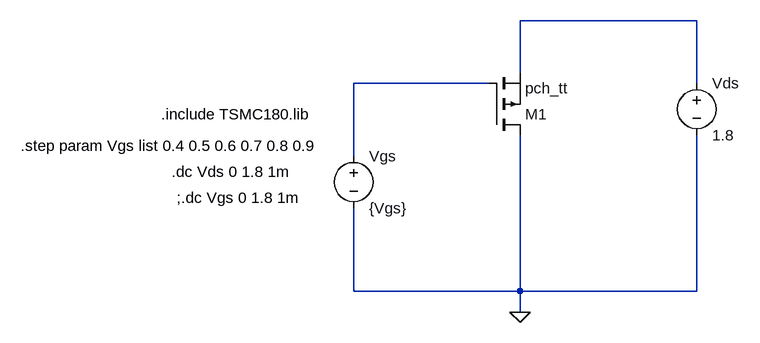
[diagram p0: schematic Draft7.asc]
Draft7.asc, the LTspice schematic file:
Version 4
SHEET 1 880 680
WIRE 688 32 416 32
WIRE 416 112 416 32
WIRE 368 128 160 128
WIRE 688 128 688 32
WIRE 160 240 160 128
WIRE 160 448 160 320
WIRE 416 448 416 208
WIRE 416 448 160 448
WIRE 688 448 688 208
WIRE 688 448 416 448
WIRE 416 480 416 448
FLAG 416 480 0
SYMBOL voltage 160 224 R0
SYMATTR InstName Vgs
SYMATTR Value {Vgs}
SYMBOL voltage 688 112 R0
SYMATTR InstName Vds
SYMATTR Value 1.8
SYMBOL pmos 368 208 M180
SYMATTR InstName M1
SYMATTR Value pch_tt
SYMATTR Value2 l=180n w=270n
TEXT -136 176 Left 2 !.include TSMC180.lib
TEXT -352 224 Left 2 !.step param Vgs list 0.4 0.5 0.6 0.7 0.8 0.9
TEXT -120 264 Left 2 !.dc Vds 0 1.8 1m
TEXT -112 304 Left 2 !;.dc Vgs 0 1.8 1m

The netlist it stands for:
* Draft7.asc
Vgs N002 0 {Vgs}
Vds N001 0 1.8
M1 0 N002 N001 N001 pch_tt l=180n w=270n
.model NMOS NMOS
.model PMOS PMOS
.lib standard.mos
.include TSMC180.lib
.step param Vgs list 0.4 0.5 0.6 0.7 0.8 0.9
.dc Vds 0 1.8 1m
;.dc Vgs 0 1.8 1m
.backanno
.end